# Altium schematic sheet FPGA_R.SchDoc: EMRT MAIN CONTROLLER
size B; DrawnBy: HUST; DocumentNumber: 9321-E-1101; Revision: REV.B; SheetNumber: 3; SheetTotal: 4
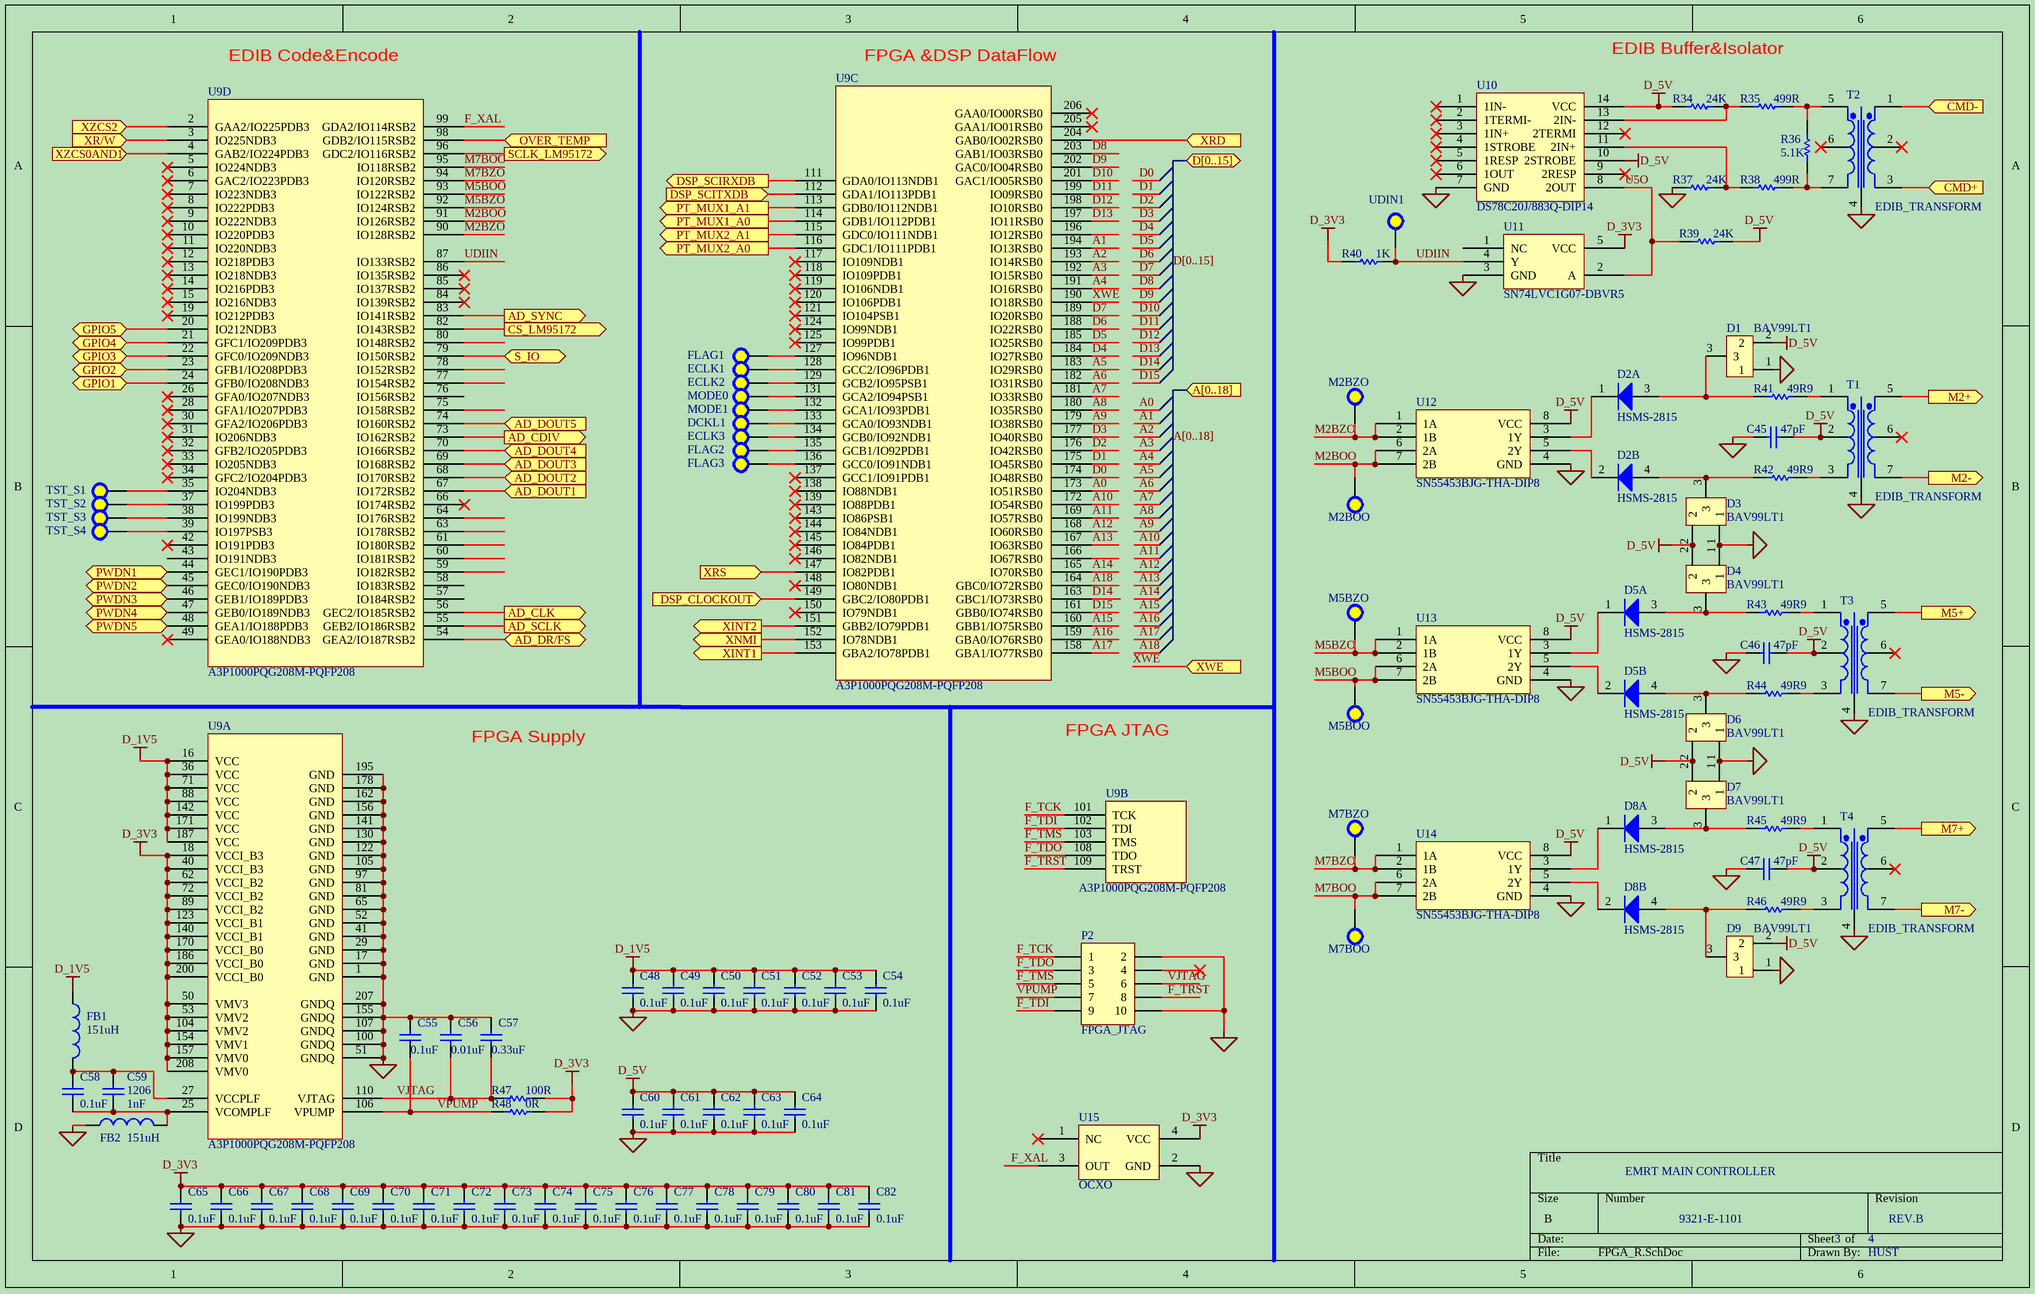
[diagram p0: FPGA_R.SchDoc]

## Parts
C45  value 47pF  [CAPS0805_57]  (hidden comment: Cap)
C46  value 47pF  [CAPS0805_57]  (hidden comment: Cap)
C47  value 47pF  [CAPS0805_57]  (hidden comment: Cap)
C48  value 0.1uF  [CAPS0805_57]  (hidden comment: Cap)
C49  value 0.1uF  [CAPS0805_57]  (hidden comment: Cap)
C50  value 0.1uF  [CAPS0805_57]  (hidden comment: Cap)
C51  value 0.1uF  [CAPS0805_57]  (hidden comment: Cap)
C52  value 0.1uF  [CAPS0805_57]  (hidden comment: Cap)
C53  value 0.1uF  [CAPS0805_57]  (hidden comment: Cap)
C54  value 0.1uF  [CAPS0805_57]  (hidden comment: Cap)
C55  value 0.1uF  [CAPS0805_57]  (hidden comment: Cap)
C56  value 0.01uF  [CAPS0805_57]  (hidden comment: Cap)
C57  value 0.33uF  [CAPS0805_57]  (hidden comment: Cap)
C58  value 0.1uF  [CAPS0805_57]  (hidden comment: Cap)
C59  1206  value 1nF  [CAPS1206_43]
C60  value 0.1uF  [CAPS0805_57]  (hidden comment: Cap)
C61  value 0.1uF  [CAPS0805_57]  (hidden comment: Cap)
C62  value 0.1uF  [CAPS0805_57]  (hidden comment: Cap)
C63  value 0.1uF  [CAPS0805_57]  (hidden comment: Cap)
C64  value 0.1uF  [CAPS0805_57]  (hidden comment: Cap)
C65  value 0.1uF  [CAPS0805_57]  (hidden comment: Cap)
C66  value 0.1uF  [CAPS0805_57]  (hidden comment: Cap)
C67  value 0.1uF  [CAPS0805_57]  (hidden comment: Cap)
C68  value 0.1uF  [CAPS0805_57]  (hidden comment: Cap)
C69  value 0.1uF  [CAPS0805_57]  (hidden comment: Cap)
C70  value 0.1uF  [CAPS0805_57]  (hidden comment: Cap)
C71  value 0.1uF  [CAPS0805_57]  (hidden comment: Cap)
C72  value 0.1uF  [CAPS0805_57]  (hidden comment: Cap)
C73  value 0.1uF  [CAPS0805_57]  (hidden comment: Cap)
C74  value 0.1uF  [CAPS0805_57]  (hidden comment: Cap)
C75  value 0.1uF  [CAPS0805_57]  (hidden comment: Cap)
C76  value 0.1uF  [CAPS0805_57]  (hidden comment: Cap)
C77  value 0.1uF  [CAPS0805_57]  (hidden comment: Cap)
C78  value 0.1uF  [CAPS0805_57]  (hidden comment: Cap)
C79  value 0.1uF  [CAPS0805_57]  (hidden comment: Cap)
C80  value 0.1uF  [CAPS0805_57]  (hidden comment: Cap)
C81  value 0.1uF  [CAPS0805_57]  (hidden comment: Cap)
C82  value 0.1uF  [CAPS0805_57]  (hidden comment: Cap)
D1  BAV99LT1  [T-PDSO_3q290×240×111_p95]
D2  HSMS-2815  [T-PDSO_4q290×240×110_p190]  (parts A,B of 2)
D3  BAV99LT1  [T-PDSO_3q290×240×111_p95]
D4  BAV99LT1  [T-PDSO_3q290×240×111_p95]
D5  HSMS-2815  [T-PDSO_4q290×240×110_p190]  (parts A,B of 2)
D6  BAV99LT1  [T-PDSO_3q290×240×111_p95]
D7  BAV99LT1  [T-PDSO_3q290×240×111_p95]
D8  HSMS-2815  [T-PDSO_4q290×240×110_p190]  (parts A,B of 2)
D9  BAV99LT1  [T-PDSO_3q290×240×111_p95]
DCKL1  TEST_SMALL  [test_small]  (value not drawn)
ECLK1  TEST_SMALL  [test_small]  (value not drawn)
ECLK2  TEST_SMALL  [test_small]  (value not drawn)
ECLK3  TEST_SMALL  [test_small]  (value not drawn)
FB1  value 151uH  [inductor_1008]  (hidden comment: Inductor)
FB2  value 151uH  [inductor_1008]  (hidden comment: Inductor)
FLAG1  TEST_SMALL  [test_small]  (value not drawn)
FLAG2  TEST_SMALL  [test_small]  (value not drawn)
FLAG3  TEST_SMALL  [test_small]  (value not drawn)
M2BOO  TEST_SMALL  [test_small]  (value not drawn)
M2BZO  TEST_SMALL  [test_small]  (value not drawn)
M5BOO  TEST_SMALL  [test_small]  (value not drawn)
M5BZO  TEST_SMALL  [test_small]  (value not drawn)
M7BOO  TEST_SMALL  [test_small]  (value not drawn)
M7BZO  TEST_SMALL  [test_small]  (value not drawn)
MODE0  TEST_SMALL  [test_small]  (value not drawn)
MODE1  TEST_SMALL  [test_small]  (value not drawn)
P2  FPGA_JTAG  [HDR2X5]
R34  value 24K  [RESS0805]  (hidden comment: Res)
R35  value 499R  [RESS0805]  (hidden comment: Res)
R36  value 5.1K  [RESS0805]  (hidden comment: Res)
R37  value 24K  [RESS0805]  (hidden comment: Res)
R38  value 499R  [RESS0805]  (hidden comment: Res)
R39  value 24K  [RESS0805]  (hidden comment: Res)
R40  value 1K  [RESS0805]  (hidden comment: Res)
R41  value 49R9  [RESS0805]  (hidden comment: Res)
R42  value 49R9  [RESS0805]  (hidden comment: Res)
R43  value 49R9  [RESS0805]  (hidden comment: Res)
R44  value 49R9  [RESS0805]  (hidden comment: Res)
R45  value 49R9  [RESS0805]  (hidden comment: Res)
R46  value 49R9  [RESS0805]  (hidden comment: Res)
R47  value 100R  [RESS0805]  (hidden comment: Res)
R48  value 0R  [RESS0805]  (hidden comment: Res)
T1  EDIB_TRANSFORM  [TRANSFORM]
T2  EDIB_TRANSFORM  [TRANSFORM]
T3  EDIB_TRANSFORM  [TRANSFORM]
T4  EDIB_TRANSFORM  [TRANSFORM]
TST_S1  TEST_SMALL  [test_small]  (value not drawn)
TST_S2  TEST_SMALL  [test_small]  (value not drawn)
TST_S3  TEST_SMALL  [test_small]  (value not drawn)
TST_S4  TEST_SMALL  [test_small]  (value not drawn)
U9  A3P1000PQG208M-PQFP208  [PQFP208]  (parts A,B,C,D of 4)
U10  DS78C20J/883Q-DIP14  [CDIP_14q785×305×200_d18_p100_i300]
U11  SN74LVC1G07-DBVR5  [PDSO_5q290×280×145_p95]
U12  SN55453BJG-THA-DIP8  [CDIP_8q405×305×200_d19_p100_i300]
U13  SN55453BJG-THA-DIP8  [CDIP_8q405×305×200_d19_p100_i300]
U14  SN55453BJG-THA-DIP8  [CDIP_8q405×305×200_d19_p100_i300]
U15  OCXO  [OCX1]
UDIN1  TEST_SMALL  [test_small]  (value not drawn)

## Ports
A[0..18], AD_CDIV (out), AD_CLK (out), AD_DOUT1 (in), AD_DOUT2 (in), AD_DOUT3 (in), AD_DOUT4 (in), AD_DOUT5 (in), AD_DR/FS (bidir), AD_SCLK (out), AD_SYNC (out), CMD+ (in), CMD- (in), CS_LM95172 (out), D[0..15] (bidir), DSP_CLOCKOUT (in), DSP_SCIRXDB (out), DSP_SCITXDB (in), GPIO1 (bidir), GPIO2 (bidir), GPIO3 (bidir), GPIO4 (bidir), GPIO5 (bidir), M2+ (out), M2- (out), M5+ (out), M5- (out), M7+ (out), M7- (out), OVER_TEMP (in), PT_MUX1_A0 (out), PT_MUX1_A1 (out), PT_MUX2_A0 (out), PT_MUX2_A1 (out), PWDN1 (out), PWDN2 (out), PWDN3 (out), PWDN4 (out), PWDN5 (out), S_IO (bidir), SCLK_LM95172 (out), XINT1 (out), XINT2 (out), XNMI (out), XR/W (in), XRD (in), XRS (in), XWE (in), XZCS0AND1 (in), XZCS2 (in)

## Nets
D_1V5: C48.2 C49.2 C50.2 C51.2 C52.2 C53.2 C54.2 FB1.1 U9.16(VCC) U9.36(VCC) U9.71(VCC) U9.88(VCC) U9.142(VCC) U9.171(VCC) U9.187(VCC)
D_3V3: C65.2 C66.2 C67.2 C68.2 C69.2 C70.2 C71.2 C72.2 C73.2 C74.2 C75.2 C76.2 C77.2 C78.2 C79.2 C80.2 C81.2 C82.2 R40.1 R47.2 R48.2 U9.18(VCCI_B3) U9.40(VCCI_B3) U9.50(VMV3) U9.53(VMV2) U9.62(VCCI_B2) U9.72(VCCI_B2) U9.89(VCCI_B2) U9.104(VMV2) U9.123(VCCI_B1) U9.140(VCCI_B1) U9.154(VMV1) U9.157(VMV0) U9.170(VCCI_B0) U9.186(VCCI_B0) U9.200(VCCI_B0) U9.208(VMV0) U11.5(VCC) U15.4(VCC)
D_5V: C45.1 C46.1 C47.1 C60.2 C61.2 C62.2 C63.2 C64.2 D1.2 D3.2 D4.2 D6.2 D7.2 D9.2 R34.2 R39.2 T1.2 T3.2 T4.2 U10.10(2STROBE) U10.14(VCC) U12.8(VCC) U13.8(VCC) U14.8(VCC)
DGND: C45.2 C46.2 C47.2 C48.1 C49.1 C50.1 C51.1 C52.1 C53.1 C54.1 C55.2 C56.2 C57.2 C60.1 C61.1 C62.1 C63.1 C64.1 C65.1 C66.1 C67.1 C68.1 C69.1 C70.1 C71.1 C72.1 C73.1 C74.1 C75.1 C76.1 C77.1 C78.1 C79.1 C80.1 C81.1 C82.1 D1.1 D3.1 D4.1 D6.1 D7.1 D9.1 FB2.1 P2.2 P2.10 R37.1 T1.4 T2.4 T3.4 T4.4 U9.1(GND) U9.17(GND) U9.29(GND) U9.41(GND) U9.51(GNDQ) U9.52(GND) U9.65(GND) U9.81(GND) U9.97(GND) U9.100(GNDQ) U9.105(GND) U9.107(GNDQ) U9.122(GND) U9.130(GND) U9.141(GND) U9.155(GNDQ) U9.156(GND) U9.162(GND) U9.178(GND) U9.195(GND) U9.207(GNDQ) U10.7(GND) U11.3(GND) U12.4(GND) U13.4(GND) U14.4(GND) U15.2(GND)
A0: U9.173(IO51RSB0)
A1: U9.194(IO13RSB0)
A2: U9.193(IO14RSB0)
A3: U9.192(IO15RSB0)
A4: U9.191(IO16RSB0)
A5: U9.183(IO29RSB0)
A6: U9.182(IO31RSB0)
A7: U9.181(IO33RSB0)
A8: U9.180(IO35RSB0)
A9: U9.179(IO38RSB0)
A10: U9.172(IO54RSB0)
A11: U9.169(IO57RSB0)
A12: U9.168(IO60RSB0)
A13: U9.167(IO63RSB0)
A14: U9.165(IO70RSB0)
A15: U9.160(GBB1/IO75RSB0)
A16: U9.159(GBA0/IO76RSB0)
A17: U9.158(GBA1/IO77RSB0)
A18: U9.164(GBC0/IO72RSB0)
AD_CDIV: U9.73(IO162RSB2) ; port AD_CDIV
AD_CLK: U9.56(GEC2/IO185RSB2) ; port AD_CLK
AD_DOUT1: U9.67(IO172RSB2) ; port AD_DOUT1
AD_DOUT2: U9.68(IO170RSB2) ; port AD_DOUT2
AD_DOUT3: U9.69(IO168RSB2) ; port AD_DOUT3
AD_DOUT4: U9.70(IO166RSB2) ; port AD_DOUT4
AD_DOUT5: U9.74(IO160RSB2) ; port AD_DOUT5
AD_DR/FS: U9.54(GEA2/IO187RSB2) ; port AD_DR/FS
AD_SCLK: U9.55(GEB2/IO186RSB2) ; port AD_SCLK
AD_SYNC: U9.83(IO141RSB2) ; port AD_SYNC
CMD+: T2.3(Pri-) ; port CMD+
CMD-: T2.1(Pri+) ; port CMD-
CS_LM95172: U9.82(IO143RSB2) ; port CS_LM95172
D0: U9.174(IO48RSB0)
D1: U9.175(IO45RSB0)
D2: U9.176(IO42RSB0)
D3: U9.177(IO40RSB0)
D4: U9.184(IO27RSB0)
D5: U9.185(IO25RSB0)
D6: U9.188(IO22RSB0)
D7: U9.189(IO20RSB0)
D8: U9.203(GAB1/IO03RSB0)
D9: U9.202(GAC0/IO04RSB0)
D10: U9.201(GAC1/IO05RSB0)
D11: U9.199(IO09RSB0)
D12: U9.198(IO10RSB0)
D13: U9.197(IO11RSB0)
D14: U9.163(GBC1/IO73RSB0)
D15: U9.161(GBB0/IO74RSB0)
DSP_CLOCKOUT: U9.149(GBC2/IO80PDB1) ; port DSP_CLOCKOUT
DSP_SCIRXDB: U9.111(GDA0/IO113NDB1) ; port DSP_SCIRXDB
DSP_SCITXDB: U9.112(GDA1/IO113PDB1) ; port DSP_SCITXDB
F_TCK: P2.1 U9.101(TCK)
F_TDI: P2.9 U9.102(TDI)
F_TDO: P2.3 U9.108(TDO)
F_TMS: P2.5 U9.103(TMS)
F_TRST: P2.8 U9.109(TRST)
F_XAL: U9.99(GDA2/IO114RSB2) U15.3(OUT)
GPIO1: U9.24(GFB0/IO208NDB3) ; port GPIO1
GPIO2: U9.23(GFB1/IO208PDB3) ; port GPIO2
GPIO3: U9.22(GFC0/IO209NDB3) ; port GPIO3
GPIO4: U9.21(GFC1/IO209PDB3) ; port GPIO4
GPIO5: U9.20(IO212NDB3) ; port GPIO5
M2+: T1.5(Sec-) ; port M2+
M2-: T1.7(Sec+) ; port M2-
M2BOO: M2BOO.1 U9.91(IO126RSB2) U12.6(2A) U12.7(2B)
M2BZO: M2BZO.1 U9.90(IO128RSB2) U12.1(1A) U12.2(1B)
M5+: T3.5(Sec-) ; port M5+
M5-: T3.7(Sec+) ; port M5-
M5BOO: M5BOO.1 U9.93(IO122RSB2) U13.6(2A) U13.7(2B)
M5BZO: M5BZO.1 U9.92(IO124RSB2) U13.1(1A) U13.2(1B)
M7+: T4.5(Sec-) ; port M7+
M7-: T4.7(Sec+) ; port M7-
M7BOO: M7BOO.1 U9.95(IO118RSB2) U14.6(2A) U14.7(2B)
M7BZO: M7BZO.1 U9.94(IO120RSB2) U14.1(1A) U14.2(1B)
OVER_TEMP: U9.98(GDB2/IO115RSB2) ; port OVER_TEMP
PT_MUX1_A0: U9.114(GDB1/IO112PDB1) ; port PT_MUX1_A0
PT_MUX1_A1: U9.113(GDB0/IO112NDB1) ; port PT_MUX1_A1
PT_MUX2_A0: U9.116(GDC1/IO111PDB1) ; port PT_MUX2_A0
PT_MUX2_A1: U9.115(GDC0/IO111NDB1) ; port PT_MUX2_A1
PWDN1: U9.44(GEC1/IO190PDB3) ; port PWDN1
PWDN2: U9.45(GEC0/IO190NDB3) ; port PWDN2
PWDN3: U9.46(GEB1/IO189PDB3) ; port PWDN3
PWDN4: U9.47(GEB0/IO189NDB3) ; port PWDN4
PWDN5: U9.48(GEA1/IO188PDB3) ; port PWDN5
S_IO: U9.79(IO150RSB2) ; port S_IO
SCLK_LM95172: U9.96(GDC2/IO116RSB2) ; port SCLK_LM95172
U5O: R39.1 U10.8(2OUT) U11.2(A)
UDIIN: R40.2 U9.87(IO133RSB2) U11.4(Y) UDIN1.1
VJTAG: C56.1 C57.1 P2.6 R47.1 U9.110(VJTAG)
VPUMP: C55.1 P2.7 R48.1 U9.106(VPUMP)
XINT1: U9.153(GBA2/IO78PDB1) ; port XINT1
XINT2: U9.151(GBB2/IO79PDB1) ; port XINT2
XNMI: U9.152(IO78NDB1) ; port XNMI
XR/W: U9.3(IO225NDB3) ; port XR/W
XRD: U9.204(GAB0/IO02RSB0) ; port XRD
XRS: U9.147(IO82PDB1) ; port XRS
XWE: U9.190(IO18RSB0) ; port XWE
XZCS0AND1: U9.4(GAB2/IO224PDB3) ; port XZCS0AND1
XZCS2: U9.2(GAA2/IO225PDB3) ; port XZCS2
NetC58_1: C58.1 C59.1 FB2.2 U9.25(VCOMPLF)
NetC58_2: C58.2 C59.2 FB1.2 U9.27(VCCPLF)
NetD1_3: D1.3 D2.3 R41.2
NetD2_1: D2.1 U12.3(1Y)
NetD2_2: D2.2 U12.5(2Y)
NetD2_4: D2.4 D3.3 R42.2
NetD4_3: D4.3 D5.3 R43.1
NetD5_1: D5.1 U13.3(1Y)
NetD5_2: D5.2 U13.5(2Y)
NetD5_4: D5.4 D6.3 R44.1
NetD7_3: D7.3 D8.3 R45.1
NetD8_1: D8.1 U14.3(1Y)
NetD8_2: D8.2 U14.5(2Y)
NetD8_4: D8.4 D9.3 R46.1
NetDCKL1_1: DCKL1.1 U9.133(GCA0/IO93NDB1)
NetECLK1_1: ECLK1.1 U9.128(GCC2/IO96PDB1)
NetECLK2_1: ECLK2.1 U9.129(GCB2/IO95PSB1)
NetECLK3_1: ECLK3.1 U9.134(GCB0/IO92NDB1)
NetFLAG1_1: FLAG1.1 U9.127(IO96NDB1)
NetFLAG2_1: FLAG2.1 U9.135(GCB1/IO92PDB1)
NetFLAG3_1: FLAG3.1 U9.136(GCC0/IO91NDB1)
NetMODE0_1: MODE0.1 U9.131(GCA2/IO94PSB1)
NetMODE1_1: MODE1.1 U9.132(GCA1/IO93PDB1)
NetR34_1: R34.1 R35.2 U10.13(2IN-)
NetR35_1: R35.1 R36.1 T2.5(Sec-)
NetR36_2: R36.2 R38.2 T2.7(Sec+)
NetR37_2: R37.2 R38.1 U10.11(2IN+)
NetR41_1: R41.1 T1.1(Pri+)
NetR42_1: R42.1 T1.3(Pri-)
NetR43_2: R43.2 T3.1(Pri+)
NetR44_2: R44.2 T3.3(Pri-)
NetR45_2: R45.2 T4.1(Pri+)
NetR46_2: R46.2 T4.3(Pri-)
NetTST_S1_1: TST_S1.1 U9.35(IO204NDB3)
NetTST_S2_1: TST_S2.1 U9.37(IO199PDB3)
NetTST_S3_1: TST_S3.1 U9.38(IO199NDB3)
NetTST_S4_1: TST_S4.1 U9.39(IO197PSB3)

Not connected (* = marked no-connect by the designer): P2 4*; T1 6(SecCT)*; T2 2* 6(SecCT)*; T3 6(SecCT)*; T4 6(SecCT)*; U9 5(IO224NDB3)* 6(GAC2/IO223PDB3)* 7(IO223NDB3)* 8(IO222PDB3)* 9(IO222NDB3)* 10(IO220PDB3)* 11(IO220NDB3)* 12(IO218PDB3)* 13(IO218NDB3)* 14(IO216PDB3)* 15(IO216NDB3)* 19(IO212PDB3)* 26(GFA0/IO207NDB3)* 28(GFA1/IO207PDB3)* 30(GFA2/IO206PDB3)* 31(IO206NDB3)* 32(GFB2/IO205PDB3)* 33(IO205NDB3)* 34(GFC2/IO204PDB3)* 42(IO191PDB3)* 43(IO191NDB3) 49(GEA0/IO188NDB3)* 57(IO184RSB2) 58(IO183RSB2) 59(IO182RSB2) 60(IO181RSB2) 61(IO180RSB2) 63(IO178RSB2) 64(IO176RSB2) 66(IO174RSB2)* 75(IO158RSB2) 76(IO156RSB2) 77(IO154RSB2) 78(IO152RSB2) 80(IO148RSB2) 84(IO139RSB2)* 85(IO137RSB2)* 86(IO135RSB2)* 117(IO109NDB1)* 118(IO109PDB1)* 119(IO106NDB1)* 120(IO106PDB1)* 121(IO104PSB1)* 124(IO99NDB1)* 125(IO99PDB1)* 137(GCC1/IO91PDB1)* 138(IO88NDB1)* 139(IO88PDB1)* 143(IO86PSB1)* 144(IO84NDB1)* 145(IO84PDB1)* 146(IO82NDB1)* 148(IO80NDB1)* 150(IO79NDB1)* 166(IO67RSB0) 196(IO12RSB0) 205(GAA1/IO01RSB0)* 206(GAA0/IO00RSB0)*; U10 1(1IN-)* 2(1TERMI-)* 3(1IN+)* 4(1STROBE)* 5(1RESP)* 6(1OUT)* 9(2RESP)* 12(2TERMI)*; U11 1(NC); U15 1(NC)*

## Buses and harness runs
bus A[0..18] = port A[0..18]
bus D[0..15] = port D[0..15]

## Notes on the sheet
- EDIB Code&Encode
- (near U9) FPGA &DSP DataFlow
- EDIB Buffer&Isolator
- FPGA Supply
- FPGA JTAG

## Library data of the parts
C45-C58 C60-C82 = Y20025084: Capacitor; 制造商型号: VJ0805H104KXA; parent: 01; 精度: ±10%; 描述: VISHAY;VJ0805H104KXA;0.1uF;±10%;50V;X8R;150℃;CAP0805; 安装形式: SMT; 湿敏等级（回流焊峰值）: 0; 产品外形尺寸<长>: 0.079±0.008 in; 产品外形尺寸<宽>: 0.049±0.008 in; 产品外形尺寸<高>: 0.057 in; id: wt.part.WTPartMaster:1053152; state: APPROVED; folder: /Default/电容/VJ0805H104KXA; Part Number: Y20025084; HelpURL: \\10.185.226.160\altium_center_db\DATASHEET\VISHAY VJ X8R.pdf; Library Path: Cap.SchLib; Library Ref: Cap; Footprint Path: VISHAY VJ0805_57.PcbLib; Footprint Ref: CAPS0805_57; pname: VJ0805H104KXA; Library Path 2: 0; Library Ref 2: 0; Footprint Path 2: 0; Footprint Ref 2: 0; Footprint Path 3: 0; Footprint Ref 3: 0
C59 = Y20024113: Capacitor; 制造商型号: C1206C105K5RAC; parent: 01; 精度: ±10%; 描述: KEMET;C1206C105K5RAC;1uF;±10%;50V;X7R;125℃;CAP1206 MSL1; 安装形式: SMT; 湿敏等级（回流焊峰值）: MSL1; 产品外形尺寸<长>: 3.2±0.2 mm; 产品外形尺寸<宽>: 1.6±0.2 mm; 产品外形尺寸<高>: 1.0±0.1 mm; Library Path 2: 0; id: wt.part.WTPartMaster:1055130; state: APPROVED; folder: /Default/电容/C1206C105K5RAC; Part Number: Y20024113; HelpURL: \\10.185.226.160\altium_center_db\DATASHEET\KEMET X7R Dielectric(Commercial Grade).pdf; Library Path: Cap.SchLib; Library Ref: Cap; Footprint Path: KEMET C1206_43.PcbLib; Footprint Ref: CAPS1206_43; pname: C1206C105K5RAC; Library Ref 2: 0; Footprint Path 2: 0; Footprint Ref 2: 0; Footprint Path 3: 0; Footprint Ref 3: 0
FB1 FB2 = Inductor: Manufacturer: Generic Components; Class: Passive; Published: 08/06/2000; Publisher: Altium Hobart Technology Centre; SubClass: Inductor
P2 = Header 5X2: Header, 5-Pin, Dual row; LatestRevisionDate: 17-Jul-2002; LatestRevisionNote: Re-released for DXP Platform.; Publisher: Altium Limited
R34-R48 = Res: Semiconductor Resistor; Manufacturer: Generic Components; Class: Passive; Published: 08/06/2000; Publisher: Altium Hobart Technology Centre; SubClass: Resistor
U9 = A3P1000
U10 = DS78C20
U11 = SN74LVC1G07
U12-U14 = SN75453BD